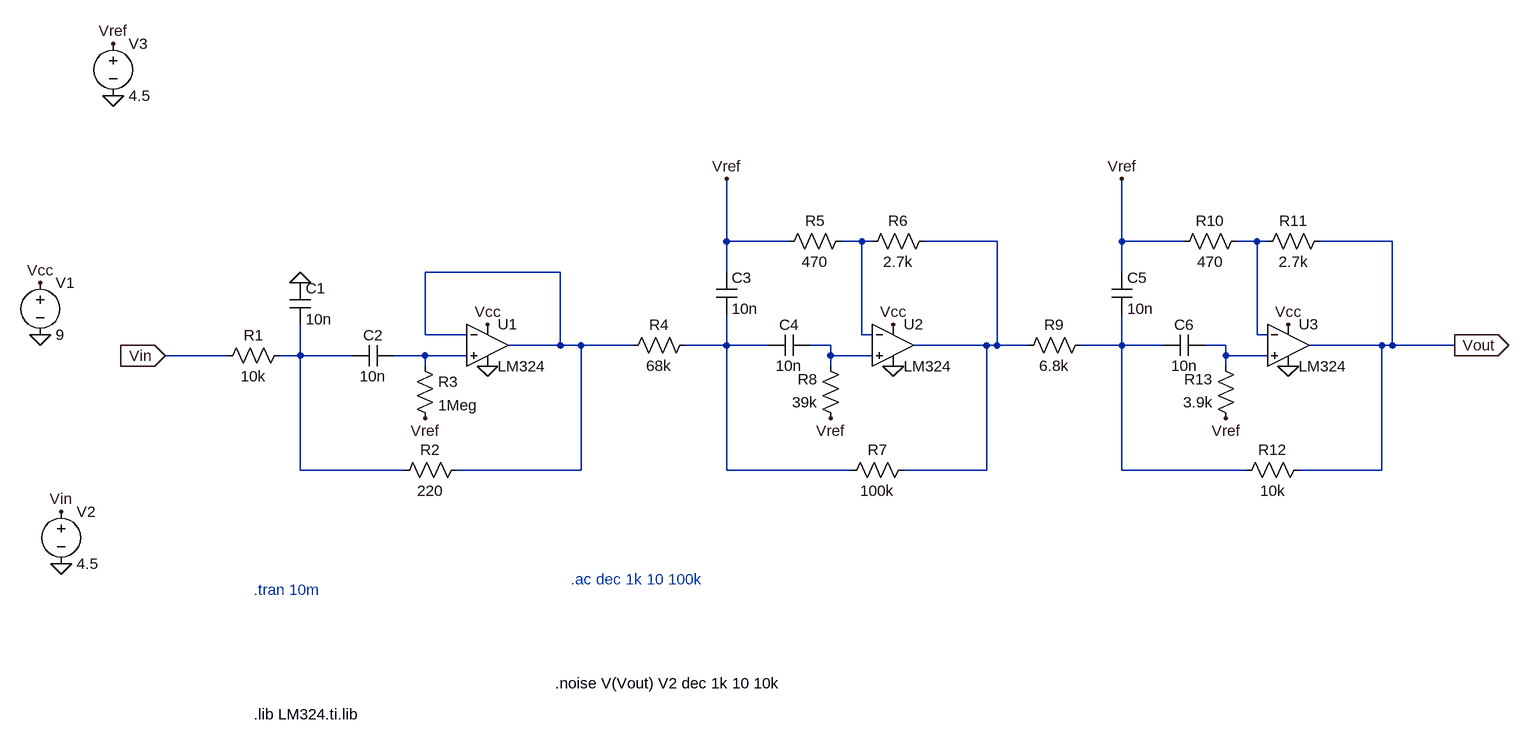
[diagram p0: schematic sallen-key.asc]
sallen-key.asc, the LTspice schematic file:
Version 4
SHEET 1 2228 1160
WIRE 1008 -16 1008 -112
WIRE 1104 -16 1008 -16
WIRE 1216 -16 1184 -16
WIRE 1232 -16 1216 -16
WIRE 1424 -16 1312 -16
WIRE 1616 -16 1616 -112
WIRE 1712 -16 1616 -16
WIRE 1824 -16 1792 -16
WIRE 1840 -16 1824 -16
WIRE 2032 -16 1920 -16
WIRE 752 32 544 32
WIRE 1008 32 1008 -16
WIRE 1616 32 1616 -16
WIRE 544 128 544 32
WIRE 608 128 544 128
WIRE 1216 128 1216 -16
WIRE 1232 128 1216 128
WIRE 1824 128 1824 -16
WIRE 1840 128 1824 128
WIRE 752 144 752 32
WIRE 752 144 672 144
WIRE 784 144 752 144
WIRE 864 144 784 144
WIRE 1008 144 1008 96
WIRE 1008 144 944 144
WIRE 1072 144 1008 144
WIRE 1168 144 1136 144
WIRE 1408 144 1296 144
WIRE 1424 144 1424 -16
WIRE 1424 144 1408 144
WIRE 1472 144 1424 144
WIRE 1616 144 1616 96
WIRE 1616 144 1552 144
WIRE 1680 144 1616 144
WIRE 1776 144 1744 144
WIRE 2016 144 1904 144
WIRE 2032 144 2032 -16
WIRE 2032 144 2016 144
WIRE 2128 144 2032 144
WIRE 240 160 144 160
WIRE 352 160 352 112
WIRE 352 160 320 160
WIRE 432 160 352 160
WIRE 544 160 496 160
WIRE 608 160 544 160
WIRE 1168 160 1168 144
WIRE 1232 160 1168 160
WIRE 1776 160 1776 144
WIRE 1840 160 1776 160
WIRE 544 176 544 160
WIRE 1168 176 1168 160
WIRE 1776 176 1776 160
WIRE 352 336 352 160
WIRE 512 336 352 336
WIRE 784 336 784 144
WIRE 784 336 592 336
WIRE 1008 336 1008 144
WIRE 1200 336 1008 336
WIRE 1408 336 1408 144
WIRE 1408 336 1280 336
WIRE 1616 336 1616 144
WIRE 1808 336 1616 336
WIRE 2016 336 2016 144
WIRE 2016 336 1888 336
FLAG -48 128 0
FLAG -48 48 Vcc
FLAG -16 480 0
FLAG -16 400 Vin
FLAG 352 48 0
FLAG 640 176 0
FLAG 640 112 Vcc
FLAG 2128 144 Vout
IOPIN 2128 144 Out
FLAG 144 160 Vin
IOPIN 144 160 In
FLAG 1264 176 0
FLAG 1264 112 Vcc
FLAG 1872 176 0
FLAG 1872 112 Vcc
FLAG 64 -240 0
FLAG 64 -320 Vref
FLAG 1008 -112 Vref
FLAG 1616 -112 Vref
FLAG 1168 256 Vref
FLAG 544 256 Vref
FLAG 1776 256 Vref
SYMBOL Voltage -48 32 R0
SYMATTR InstName V1
SYMATTR Value 9
SYMBOL Voltage -16 384 R0
SYMATTR InstName V2
SYMATTR Value 4.5
SYMATTR Value2 AC 1 0
SYMBOL Res 336 144 R90
WINDOW 0 0 56 VBottom 2
WINDOW 3 32 56 VTop 2
SYMATTR InstName R1
SYMATTR Value 10k
SYMBOL Res 608 320 R90
WINDOW 0 0 56 VBottom 2
WINDOW 3 32 56 VTop 2
SYMATTR InstName R2
SYMATTR Value 220
SYMBOL Cap 336 48 R0
SYMATTR InstName C1
SYMATTR Value 10n
SYMBOL Cap 496 144 R90
WINDOW 0 0 32 VBottom 2
WINDOW 3 32 32 VTop 2
SYMATTR InstName C2
SYMATTR Value 10n
SYMBOL Res 528 160 R0
SYMATTR InstName R3
SYMATTR Value 1Meg
SYMBOL Res 960 128 R90
WINDOW 0 0 56 VBottom 2
WINDOW 3 32 56 VTop 2
SYMATTR InstName R4
SYMATTR Value 68k
SYMBOL Res 1200 -32 R90
WINDOW 0 0 56 VBottom 2
WINDOW 3 32 56 VTop 2
SYMATTR InstName R5
SYMATTR Value 470
SYMBOL Res 1328 -32 R90
WINDOW 0 0 56 VBottom 2
WINDOW 3 32 56 VTop 2
SYMATTR InstName R6
SYMATTR Value 2.7k
SYMBOL Res 1296 320 R90
WINDOW 0 0 56 VBottom 2
WINDOW 3 32 56 VTop 2
SYMATTR InstName R7
SYMATTR Value 100k
SYMBOL Res 1184 272 R180
WINDOW 0 36 76 Left 2
WINDOW 3 36 40 Left 2
SYMATTR InstName R8
SYMATTR Value 39k
SYMBOL Cap 992 32 R0
SYMATTR InstName C3
SYMATTR Value 10n
SYMBOL Cap 1136 128 R90
WINDOW 0 0 32 VBottom 2
WINDOW 3 32 32 VTop 2
SYMATTR InstName C4
SYMATTR Value 10n
SYMBOL Res 1568 128 R90
WINDOW 0 0 56 VBottom 2
WINDOW 3 32 56 VTop 2
SYMATTR InstName R9
SYMATTR Value 6.8k
SYMBOL Res 1808 -32 R90
WINDOW 0 0 56 VBottom 2
WINDOW 3 32 56 VTop 2
SYMATTR InstName R10
SYMATTR Value 470
SYMBOL Res 1936 -32 R90
WINDOW 0 0 56 VBottom 2
WINDOW 3 32 56 VTop 2
SYMATTR InstName R11
SYMATTR Value 2.7k
SYMBOL Res 1904 320 R90
WINDOW 0 0 56 VBottom 2
WINDOW 3 32 56 VTop 2
SYMATTR InstName R12
SYMATTR Value 10k
SYMBOL Res 1792 272 R180
WINDOW 0 36 76 Left 2
WINDOW 3 36 40 Left 2
SYMATTR InstName R13
SYMATTR Value 3.9k
SYMBOL Cap 1600 32 R0
SYMATTR InstName C5
SYMATTR Value 10n
SYMBOL Cap 1744 128 R90
WINDOW 0 0 32 VBottom 2
WINDOW 3 32 32 VTop 2
SYMATTR InstName C6
SYMATTR Value 10n
SYMBOL opamp2 640 80 R0
SYMATTR InstName U1
SYMATTR Value LM324
SYMBOL opamp2 1264 80 R0
SYMATTR InstName U2
SYMATTR Value LM324
SYMBOL opamp2 1872 80 R0
SYMATTR InstName U3
SYMATTR Value LM324
SYMBOL Voltage 64 -336 R0
SYMATTR InstName V3
SYMATTR Value 4.5
TEXT 280 520 Left 2 ;.tran 10m
TEXT 768 504 Left 2 ;.ac dec 1k 10 100k
TEXT 280 712 Left 2 !.lib LM324.ti.lib
TEXT 744 664 Left 2 !.noise V(Vout) V2 dec 1k 10 10k

The netlist it stands for:
* sallen-key.asc
V1 Vcc 0 9
V2 Vin 0 4.5 AC 1 0
R1 N009 Vin 10k
R2 N004 N009 220
C1 0 N009 10n
C2 N010 N009 10n
R3 N010 Vref 1Meg
R4 N005 N004 68k
R5 N001 Vref 470
R6 N002 N001 2.7k
R7 N002 N005 100k
R8 Vref N006 39k
C3 Vref N005 10n
C4 N006 N005 10n
R9 N007 N002 6.8k
R10 N003 Vref 470
R11 Vout N003 2.7k
R12 Vout N007 10k
R13 Vref N008 3.9k
C5 Vref N007 10n
C6 N008 N007 10n
XU1 N010 N004 Vcc 0 N004 LM324  ; pins In+ In- V+ V- OUT
XU2 N006 N001 Vcc 0 N002 LM324  ; pins In+ In- V+ V- OUT
XU3 N008 N003 Vcc 0 Vout LM324  ; pins In+ In- V+ V- OUT
V3 Vref 0 4.5
* .tran 10m
* .ac dec 1k 10 100k
.lib LM324.ti.lib
.noise V(Vout) V2 dec 1k 10 10k
.backanno
.end